# Altium project controller.PrjPcb
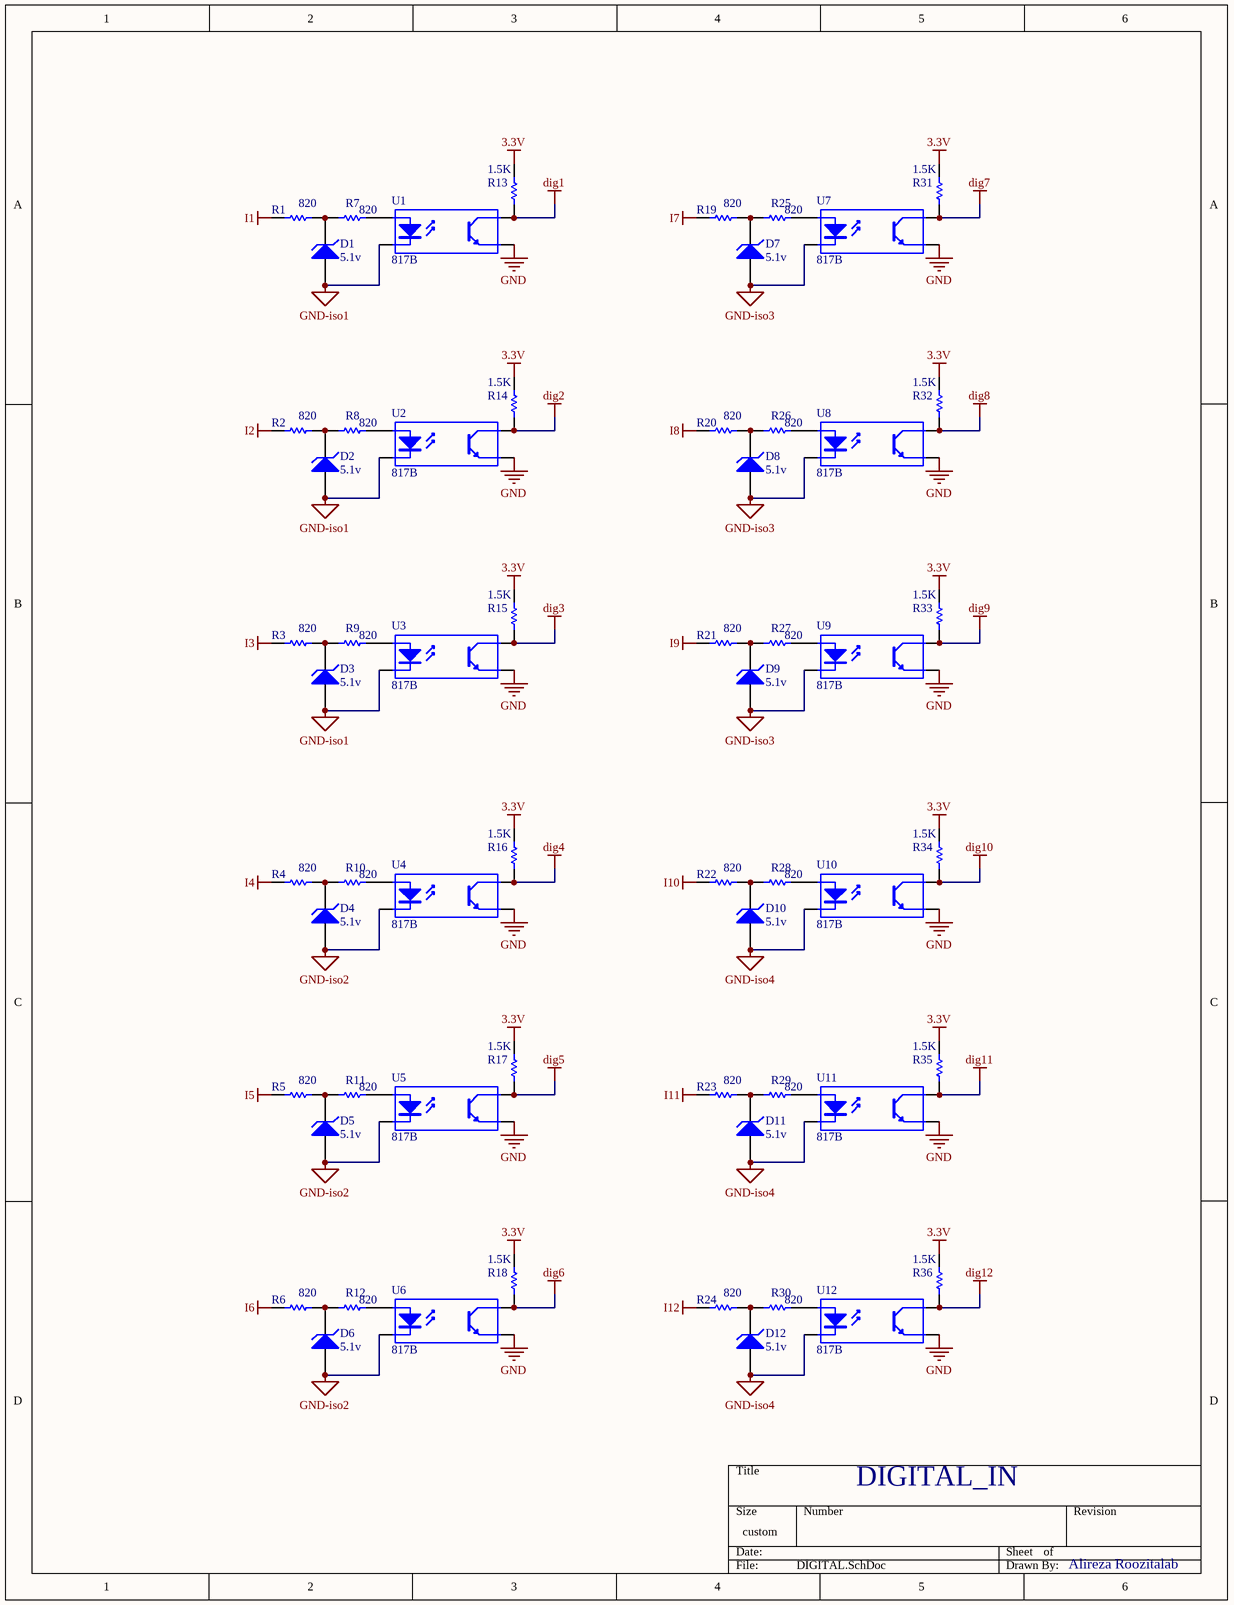
[diagram p0: DIGITAL.SchDoc]
8 sheets, 227 parts. Net scope: global (net labels, ports and power ports of the same name join across sheets).
Board file: controller.PcbDoc
Sheets:
  DIGITAL.SchDoc
  RELAY.SchDoc
  ANALOG.SchDoc
  MOSFET.SchDoc
  COMMUNICATION.SchDoc
  CORE.SchDoc
  POWER.SchDoc
  OUTPUT.SchDoc

## Sheet DIGITAL.SchDoc
size 229 x 299 mm

### Parts
D1  5.1v  [Diode-1n4148 - SMD PAD]
D2  5.1v  [Diode-1n4148 - SMD PAD]
D3  5.1v  [Diode-1n4148 - SMD PAD]
D4  5.1v  [Diode-1n4148 - SMD PAD]
D5  5.1v  [Diode-1n4148 - SMD PAD]
D6  5.1v  [Diode-1n4148 - SMD PAD]
D7  5.1v  [Diode-1n4148 - SMD PAD]
D8  5.1v  [Diode-1n4148 - SMD PAD]
D9  5.1v  [Diode-1n4148 - SMD PAD]
D10  5.1v  [Diode-1n4148 - SMD PAD]
D11  5.1v  [Diode-1n4148 - SMD PAD]
D12  5.1v  [Diode-1n4148 - SMD PAD]
R1  value 820  [RES 1206 (3216X08L)]  (hidden comment: Res Semi)
R2  value 820  [RES 1206 (3216X08L)]  (hidden comment: Res Semi)
R3  value 820  [RES 1206 (3216X08L)]  (hidden comment: Res Semi)
R4  value 820  [RES 1206 (3216X08L)]  (hidden comment: Res Semi)
R5  value 820  [RES 1206 (3216X08L)]  (hidden comment: Res Semi)
R6  value 820  [RES 1206 (3216X08L)]  (hidden comment: Res Semi)
R7  value 820  [RES 1206 (3216X08L)]  (hidden comment: Res Semi)
R8  value 820  [RES 1206 (3216X08L)]  (hidden comment: Res Semi)
R9  value 820  [RES 1206 (3216X08L)]  (hidden comment: Res Semi)
R10  value 820  [RES 1206 (3216X08L)]  (hidden comment: Res Semi)
R11  value 820  [RES 1206 (3216X08L)]  (hidden comment: Res Semi)
R12  value 820  [RES 1206 (3216X08L)]  (hidden comment: Res Semi)
R13  value 1.5K  [RES 1206 (3216X08L)]  (hidden comment: Res Semi)
R14  value 1.5K  [RES 1206 (3216X08L)]  (hidden comment: Res Semi)
R15  value 1.5K  [RES 1206 (3216X08L)]  (hidden comment: Res Semi)
R16  value 1.5K  [RES 1206 (3216X08L)]  (hidden comment: Res Semi)
R17  value 1.5K  [RES 1206 (3216X08L)]  (hidden comment: Res Semi)
R18  value 1.5K  [RES 1206 (3216X08L)]  (hidden comment: Res Semi)
R19  value 820  [RES 1206 (3216X08L)]  (hidden comment: Res Semi)
R20  value 820  [RES 1206 (3216X08L)]  (hidden comment: Res Semi)
R21  value 820  [RES 1206 (3216X08L)]  (hidden comment: Res Semi)
R22  value 820  [RES 1206 (3216X08L)]  (hidden comment: Res Semi)
R23  value 820  [RES 1206 (3216X08L)]  (hidden comment: Res Semi)
R24  value 820  [RES 1206 (3216X08L)]  (hidden comment: Res Semi)
R25  value 820  [RES 1206 (3216X08L)]  (hidden comment: Res Semi)
R26  value 820  [RES 1206 (3216X08L)]  (hidden comment: Res Semi)
R27  value 820  [RES 1206 (3216X08L)]  (hidden comment: Res Semi)
R28  value 820  [RES 1206 (3216X08L)]  (hidden comment: Res Semi)
R29  value 820  [RES 1206 (3216X08L)]  (hidden comment: Res Semi)
R30  value 820  [RES 1206 (3216X08L)]  (hidden comment: Res Semi)
R31  value 1.5K  [RES 1206 (3216X08L)]  (hidden comment: Res Semi)
R32  value 1.5K  [RES 1206 (3216X08L)]  (hidden comment: Res Semi)
R33  value 1.5K  [RES 1206 (3216X08L)]  (hidden comment: Res Semi)
R34  value 1.5K  [RES 1206 (3216X08L)]  (hidden comment: Res Semi)
R35  value 1.5K  [RES 1206 (3216X08L)]  (hidden comment: Res Semi)
R36  value 1.5K  [RES 1206 (3216X08L)]  (hidden comment: Res Semi)
U1  817B  [DIP+4]
U2  817B  [DIP+4]
U3  817B  [DIP+4]
U4  817B  [DIP+4]
U5  817B  [DIP+4]
U6  817B  [DIP+4]
U7  817B  [DIP+4]
U8  817B  [DIP+4]
U9  817B  [DIP+4]
U10  817B  [DIP+4]
U11  817B  [DIP+4]
U12  817B  [DIP+4]

### Nets
3.3V: R13.2 R14.2 R15.2 R16.2 R17.2 R18.2 R31.2 R32.2 R33.2 R34.2 R35.2 R36.2
dig1: R13.1 U1.4(C)
dig2: R14.1 U2.4(C)
dig3: R15.1 U3.4(C)
dig4: R16.1 U4.4(C)
dig5: R17.1 U5.4(C)
dig6: R18.1 U6.4(C)
dig7: R31.1 U7.4(C)
dig8: R32.1 U8.4(C)
dig9: R33.1 U9.4(C)
dig10: R34.1 U10.4(C)
dig11: R35.1 U11.4(C)
dig12: R36.1 U12.4(C)
GND: U1.3(E) U2.3(E) U3.3(E) U4.3(E) U5.3(E) U6.3(E) U7.3(E) U8.3(E) U9.3(E) U10.3(E) U11.3(E) U12.3(E)
GND-iso1: D1.1(A) D2.1(A) D3.1(A) U1.2(K) U2.2(K) U3.2(K)
GND-iso2: D4.1(A) D5.1(A) D6.1(A) U4.2(K) U5.2(K) U6.2(K)
GND-iso3: D7.1(A) D8.1(A) D9.1(A) U7.2(K) U8.2(K) U9.2(K)
GND-iso4: D10.1(A) D11.1(A) D12.1(A) U10.2(K) U11.2(K) U12.2(K)
I1: R1.1
I2: R2.1
I3: R3.1
I4: R4.1
I5: R5.1
I6: R6.1
I7: R19.1
I8: R20.1
I9: R21.1
I10: R22.1
I11: R23.1
I12: R24.1
NetD1_2: D1.2(K) R1.2 R7.1
NetD2_2: D2.2(K) R2.2 R8.1
NetD3_2: D3.2(K) R3.2 R9.1
NetD4_2: D4.2(K) R4.2 R10.1
NetD5_2: D5.2(K) R5.2 R11.1
NetD6_2: D6.2(K) R6.2 R12.1
NetD7_2: D7.2(K) R19.2 R25.1
NetD8_2: D8.2(K) R20.2 R26.1
NetD9_2: D9.2(K) R21.2 R27.1
NetD10_2: D10.2(K) R22.2 R28.1
NetD11_2: D11.2(K) R23.2 R29.1
NetD12_2: D12.2(K) R24.2 R30.1
NetR7_2: R7.2 U1.1(A)
NetR8_2: R8.2 U2.1(A)
NetR9_2: R9.2 U3.1(A)
NetR10_2: R10.2 U4.1(A)
NetR11_2: R11.2 U5.1(A)
NetR12_2: R12.2 U6.1(A)
NetR25_2: R25.2 U7.1(A)
NetR26_2: R26.2 U8.1(A)
NetR27_2: R27.2 U9.1(A)
NetR28_2: R28.2 U10.1(A)
NetR29_2: R29.2 U11.1(A)
NetR30_2: R30.2 U12.1(A)

### Notes on the sheet
- DIGITAL_IN
- Alireza Roozitalab

### Library data of the parts
D1-D12 = D Zener: Zener Diode; Published: 8-Jun-2000; LatestRevisionDate: 17-Jul-2002; LatestRevisionNote: Re-released for DXP Platform.; PackageReference: DIODE-0.7; Publisher: Altium Limited
R1-R36 = Res Semi: Semiconductor Resistor; Published: 8-Jun-2000; LatestRevisionDate: 17-Jul-2002; LatestRevisionNote: Re-released for DXP Platform.; PackageReference: AXIAL-0.5; Publisher: Altium Limited
U1-U12 = Optoisolator1: 4-Pin Phototransistor Optocoupler; Published: 24-Mar-1999; LatestRevisionDate: 04-Mar-2005; LatestRevisionNote: Sch pins 3 & 4 Swapped.; DatasheetDocument: Nov-2003; PackageReference: DIP-4; Publisher: Altium Limited

## Sheet RELAY.SchDoc
size 199 x 199 mm
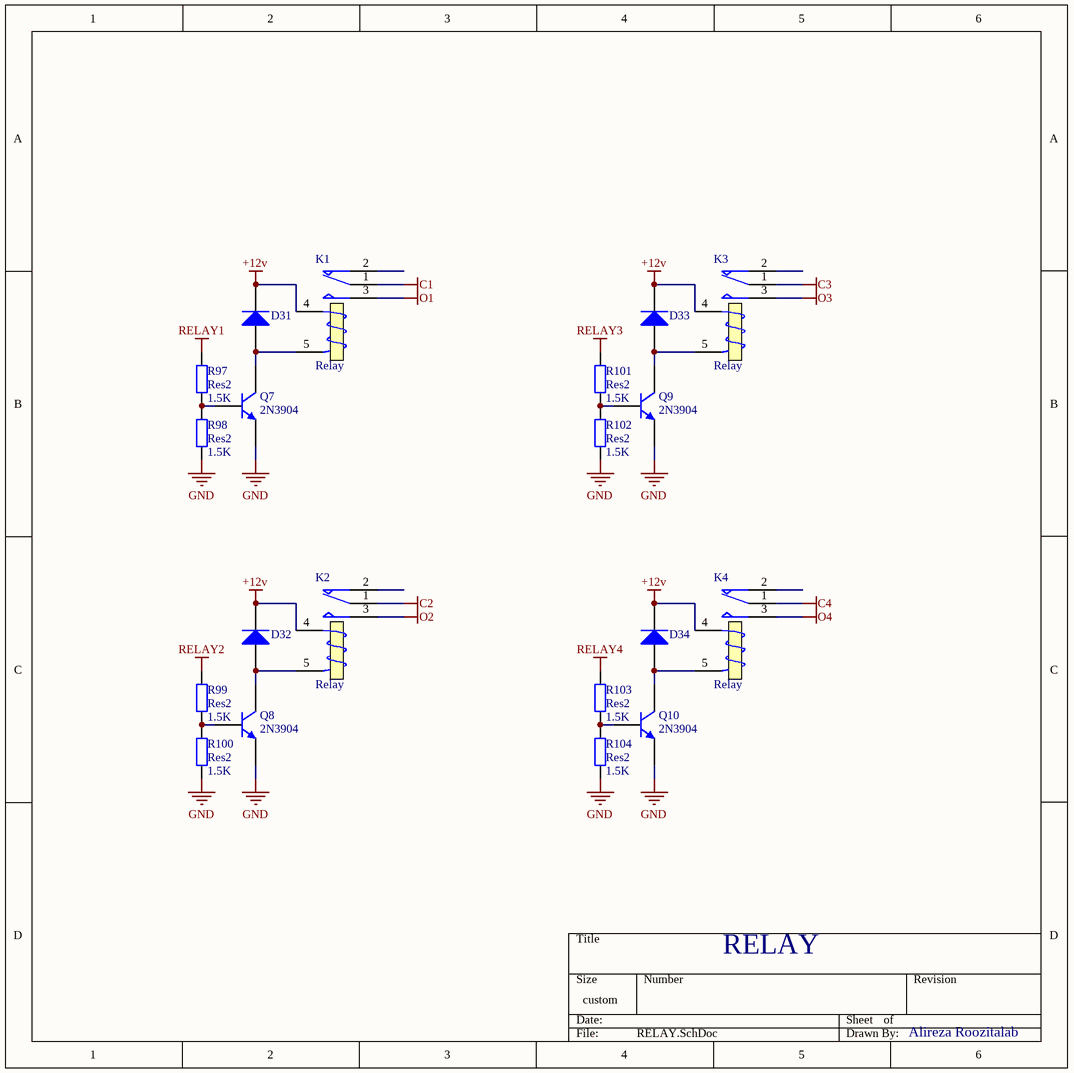
[diagram p1: RELAY.SchDoc]

### Parts
D31  Diode 1N4148  [Diode-1n4148 - SMD PAD]  (value not drawn)
D32  Diode 1N4148  [Diode-1n4148 - SMD PAD]  (value not drawn)
D33  Diode 1N4148  [Diode-1n4148 - SMD PAD]  (value not drawn)
D34  Diode 1N4148  [Diode-1n4148 - SMD PAD]  (value not drawn)
K1  Relay  [RELAY 12V ATX203]
K2  Relay  [RELAY 12V ATX203]
K3  Relay  [RELAY 12V ATX203]
K4  Relay  [RELAY 12V ATX203]
Q7  2N3904  [2N3906_SMD]
Q8  2N3904  [2N3906_SMD]
Q9  2N3904  [2N3906_SMD]
Q10  2N3904  [2N3906_SMD]
R97  Res2  value 1.5K  [RES 1206 (3216X08L)]
R98  Res2  value 1.5K  [RES 1206 (3216X08L)]
R99  Res2  value 1.5K  [RES 1206 (3216X08L)]
R100  Res2  value 1.5K  [RES 1206 (3216X08L)]
R101  Res2  value 1.5K  [RES 1206 (3216X08L)]
R102  Res2  value 1.5K  [RES 1206 (3216X08L)]
R103  Res2  value 1.5K  [RES 1206 (3216X08L)]
R104  Res2  value 1.5K  [RES 1206 (3216X08L)]

### Nets
+12v: D31.2(K) D32.2(K) D33.2(K) D34.2(K) K1.4 K2.4 K3.4 K4.4
C1: K1.1
C2: K2.1
C3: K3.1
C4: K4.1
GND: Q7.1(E) Q8.1(E) Q9.1(E) Q10.1(E) R98.1 R100.1 R102.1 R104.1
O1: K1.3
O2: K2.3
O3: K3.3
O4: K4.3
RELAY1: R97.2
RELAY2: R99.2
RELAY3: R101.2
RELAY4: R103.2
NetD31_1: D31.1(A) K1.5 Q7.3(C)
NetD32_1: D32.1(A) K2.5 Q8.3(C)
NetD33_1: D33.1(A) K3.5 Q9.3(C)
NetD34_1: D34.1(A) K4.5 Q10.3(C)
NetQ7_2: Q7.2(B) R97.1 R98.2
NetQ8_2: Q8.2(B) R99.1 R100.2
NetQ9_2: Q9.2(B) R101.1 R102.2
NetQ10_2: Q10.2(B) R103.1 R104.2

Not connected (* = marked no-connect by the designer): K1 2; K2 2; K3 2; K4 2

### Notes on the sheet
- RELAY
- Alireza Roozitalab

### Library data of the parts
D31-D34 = Diode 1N4148: High Conductance Fast Diode; Published: 8-Jun-2000; LatestRevisionDate: 17-Jul-2002; LatestRevisionNote: Re-released for DXP Platform.; DatasheetDocument: 1997; PackageReference: DO-35; Publisher: Altium Limited; Code_JEDEC: DO-204-AH; ComponentLink1Description: Manufacturer Link; ComponentLink1URL: http://www.fairchildsemi.com/; ComponentLink2Description: Datasheet; ComponentLink2URL: http://www.fairchildsemi.com/ds/1N%2F1N4148.pdf
K1-K4 = Relay: SPDT Relay; Published: 8-Jun-2000; LatestRevisionDate: 17-Jul-2002; LatestRevisionNote: Re-released for DXP Platform.; PackageReference: MODULE5B; Publisher: Altium Limited
Q7-Q10 = 2N3904: NPN General Purpose Amplifier; pin to pad: 1>2 2>1; Published: 8-Jun-2000; LatestRevisionDate: 15-Jan-2003; LatestRevisionNote: PCB Footprint 'BCY-W3/D4.7' replaced; DatasheetDocument: 1997; PackageDocument: Sep-1998; PackageReference: TO-92A; Publisher: Altium Limited; Code_JEDEC: TO-92A; ComponentLink1Description: Manufacturer Link; ComponentLink1URL: http://www.fairchildsemi.com/; ComponentLink2Description: Datasheet; ComponentLink2URL: http://www.fairchildsemi.com/ds/2N%2F2N3904.pdf
R97-R104 = Res2: Resistor; Published: 8-Jun-2000; LatestRevisionDate: 17-Jul-2002; LatestRevisionNote: Re-released for DXP Platform.; PackageReference: AXIAL-0.4; Publisher: Altium Limited

## Sheet ANALOG.SchDoc
size A3
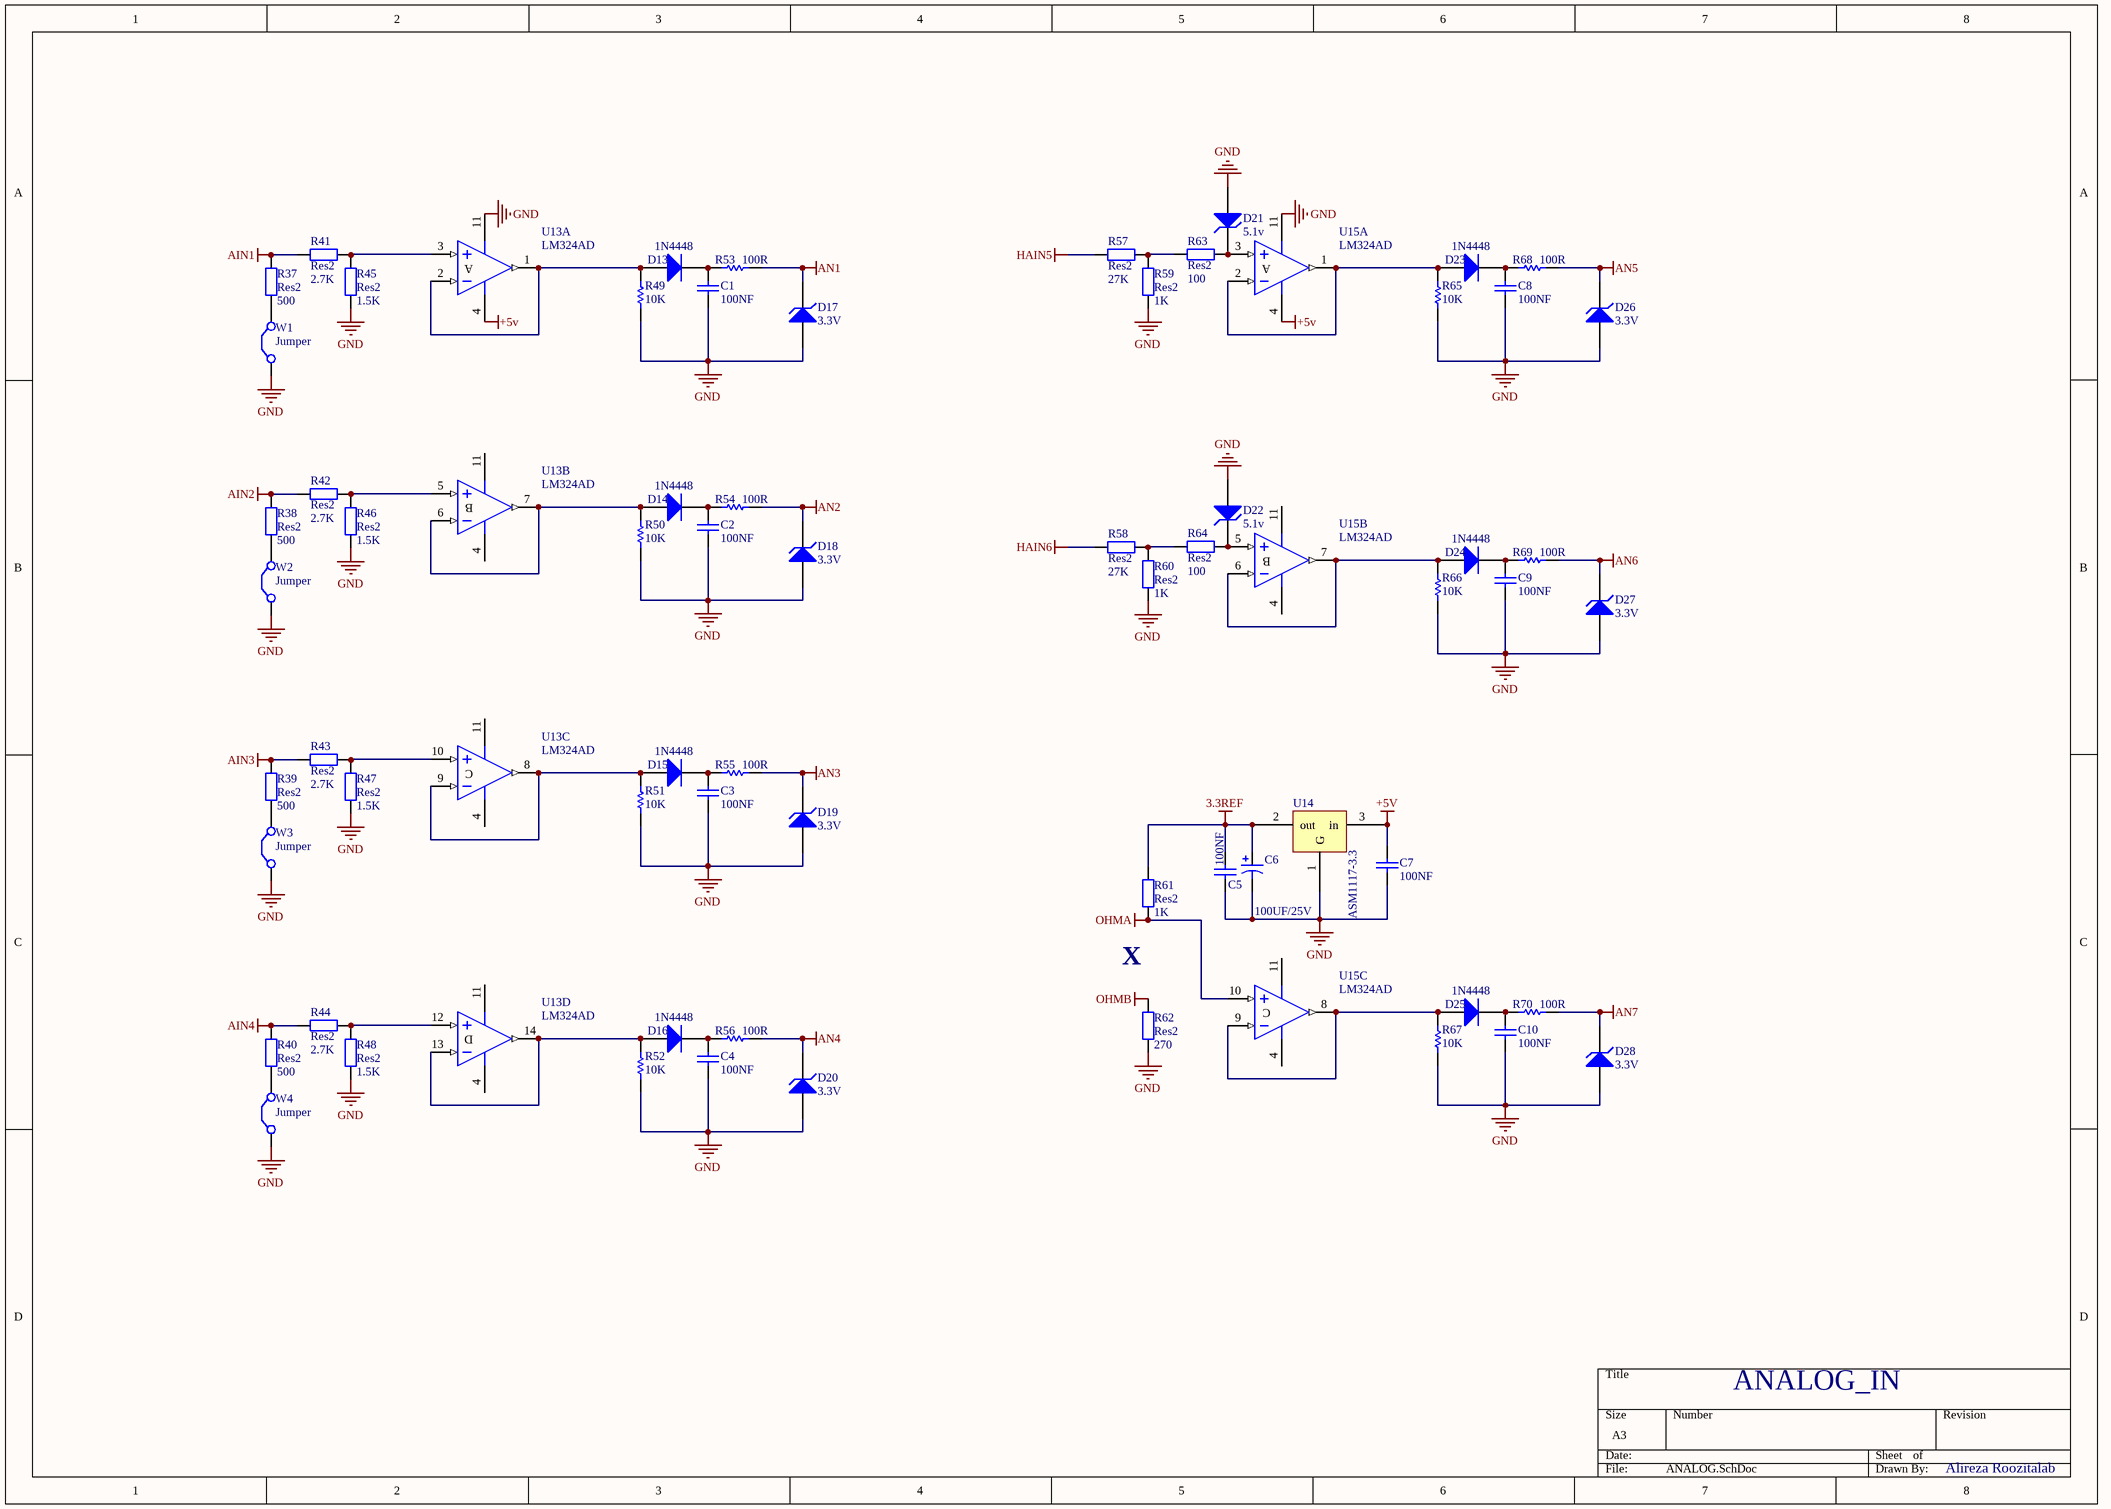
[diagram p2: ANALOG.SchDoc]

### Parts
C1  value 100NF  [CAP 1206 (3216X08L)]  (hidden comment: Cap)
C2  value 100NF  [CAP 1206 (3216X08L)]  (hidden comment: Cap)
C3  value 100NF  [CAP 1206 (3216X08L)]  (hidden comment: Cap)
C4  value 100NF  [CAP 1206 (3216X08L)]  (hidden comment: Cap)
C5  value 100NF  [CAP 1206 (3216X08L)]  (hidden comment: Cap)
C6  value 100UF/25V  [POL 100U/25V]  (hidden comment: Cap Pol1)
C7  value 100NF  [CAP 1206 (3216X08L)]  (hidden comment: Cap)
C8  value 100NF  [CAP 1206 (3216X08L)]  (hidden comment: Cap)
C9  value 100NF  [CAP 1206 (3216X08L)]  (hidden comment: Cap)
C10  value 100NF  [CAP 1206 (3216X08L)]  (hidden comment: Cap)
D13  1N4448  [Diode-1n4148 - SMD PAD]
D14  1N4448  [Diode-1n4148 - SMD PAD]
D15  1N4448  [Diode-1n4148 - SMD PAD]
D16  1N4448  [Diode-1n4148 - SMD PAD]
D17  3.3V  [Diode-1n4148 - SMD PAD]
D18  3.3V  [Diode-1n4148 - SMD PAD]
D19  3.3V  [Diode-1n4148 - SMD PAD]
D20  3.3V  [Diode-1n4148 - SMD PAD]
D21  5.1v  [Diode-1n4148 - SMD PAD]
D22  5.1v  [Diode-1n4148 - SMD PAD]
D23  1N4448  [Diode-1n4148 - SMD PAD]
D24  1N4448  [Diode-1n4148 - SMD PAD]
D25  1N4448  [Diode-1n4148 - SMD PAD]
D26  3.3V  [Diode-1n4148 - SMD PAD]
D27  3.3V  [Diode-1n4148 - SMD PAD]
D28  3.3V  [Diode-1n4148 - SMD PAD]
R37  Res2  value 500  [RES 1206 (3216X08L)]
R38  Res2  value 500  [RES 1206 (3216X08L)]
R39  Res2  value 500  [RES 1206 (3216X08L)]
R40  Res2  value 500  [RES 1206 (3216X08L)]
R41  Res2  value 2.7K  [RES 1206 (3216X08L)]
R42  Res2  value 2.7K  [RES 1206 (3216X08L)]
R43  Res2  value 2.7K  [RES 1206 (3216X08L)]
R44  Res2  value 2.7K  [RES 1206 (3216X08L)]
R45  Res2  value 1.5K  [RES 1206 (3216X08L)]
R46  Res2  value 1.5K  [RES 1206 (3216X08L)]
R47  Res2  value 1.5K  [RES 1206 (3216X08L)]
R48  Res2  value 1.5K  [RES 1206 (3216X08L)]
R49  value 10K  [RES 1206 (3216X08L)]  (hidden comment: Res Semi)
R50  value 10K  [RES 1206 (3216X08L)]  (hidden comment: Res Semi)
R51  value 10K  [RES 1206 (3216X08L)]  (hidden comment: Res Semi)
R52  value 10K  [RES 1206 (3216X08L)]  (hidden comment: Res Semi)
R53  value 100R  [RES 1206 (3216X08L)]  (hidden comment: Res Semi)
R54  value 100R  [RES 1206 (3216X08L)]  (hidden comment: Res Semi)
R55  value 100R  [RES 1206 (3216X08L)]  (hidden comment: Res Semi)
R56  value 100R  [RES 1206 (3216X08L)]  (hidden comment: Res Semi)
R57  Res2  value 27K  [RES 1206 (3216X08L)]
R58  Res2  value 27K  [RES 1206 (3216X08L)]
R59  Res2  value 1K  [RES 1206 (3216X08L)]
R60  Res2  value 1K  [RES 1206 (3216X08L)]
R61  Res2  value 1K  [RES 1206 (3216X08L)]
R62  Res2  value 270  [RES 1206 (3216X08L)]
R63  Res2  value 100  [RES 1206 (3216X08L)]
R64  Res2  value 100  [RES 1206 (3216X08L)]
R65  value 10K  [RES 1206 (3216X08L)]  (hidden comment: Res Semi)
R66  value 10K  [RES 1206 (3216X08L)]  (hidden comment: Res Semi)
R67  value 10K  [RES 1206 (3216X08L)]  (hidden comment: Res Semi)
R68  value 100R  [RES 1206 (3216X08L)]  (hidden comment: Res Semi)
R69  value 100R  [RES 1206 (3216X08L)]  (hidden comment: Res Semi)
R70  value 100R  [RES 1206 (3216X08L)]  (hidden comment: Res Semi)
U13  LM324AD  [SOP-14]  (parts A,B,C,D of 4)
U14  ASM1117-3.3  [SOT-223]
U15  LM324AD  [SOP-14]  (parts A,B,C of 4)
W1  Jumper  [RES 0402 (1005X04L)]
W2  Jumper  [RES 0402 (1005X04L)]
W3  Jumper  [RES 0402 (1005X04L)]
W4  Jumper  [RES 0402 (1005X04L)]

### Nets
3.3REF: C5.2 C6.1 R61.2 U14.2(out)
+5v: C7.2 U13.4(V+) U14.3(in) U15.4(V+)
AIN1: R37.2 R41.1
AIN2: R38.2 R42.1
AIN3: R39.2 R43.1
AIN4: R40.2 R44.1
AN1: D17.2(K) R53.2
AN2: D18.2(K) R54.2
AN3: D19.2(K) R55.2
AN4: D20.2(K) R56.2
AN5: D26.2(K) R68.2
AN6: D27.2(K) R69.2
AN7: D28.2(K) R70.2
GND: C1.2 C2.2 C3.2 C4.2 C5.1 C6.2 C7.1 C8.2 C9.2 C10.2 D17.1(A) D18.1(A) D19.1(A) D20.1(A) D21.1(A) D22.1(A) D26.1(A) D27.1(A) D28.1(A) R45.1 R46.1 R47.1 R48.1 R49.1 R50.1 R51.1 R52.1 R59.1 R60.1 R62.1 R65.1 R66.1 R67.1 U13.11(V-) U14.1(G) U15.11(V-) W1.1(C1) W2.1(C1) W3.1(C1) W4.1(C1)
HAIN5: R57.1
HAIN6: R58.1
OHMA: R61.1 U15.10(IN+)
OHMB: R62.2
NetC1_1: C1.1 D13.2(K) R53.1
NetC2_1: C2.1 D14.2(K) R54.1
NetC3_1: C3.1 D15.2(K) R55.1
NetC4_1: C4.1 D16.2(K) R56.1
NetC8_1: C8.1 D23.2(K) R68.1
NetC9_1: C9.1 D24.2(K) R69.1
NetC10_1: C10.1 D25.2(K) R70.1
NetD13_1: D13.1(A) R49.2 U13.1(OUT) U13.2(IN-)
NetD14_1: D14.1(A) R50.2 U13.6(IN-) U13.7(OUT)
NetD15_1: D15.1(A) R51.2 U13.8(OUT) U13.9(IN-)
NetD16_1: D16.1(A) R52.2 U13.13(IN-) U13.14(OUT)
NetD21_2: D21.2(K) R63.2 U15.3(IN+)
NetD22_2: D22.2(K) R64.2 U15.5(IN+)
NetD23_1: D23.1(A) R65.2 U15.1(OUT) U15.2(IN-)
NetD24_1: D24.1(A) R66.2 U15.6(IN-) U15.7(OUT)
NetD25_1: D25.1(A) R67.2 U15.8(OUT) U15.9(IN-)
NetR37_1: R37.1 W1.2(C2)
NetR38_1: R38.1 W2.2(C2)
NetR39_1: R39.1 W3.2(C2)
NetR40_1: R40.1 W4.2(C2)
NetR41_2: R41.2 R45.2 U13.3(IN+)
NetR42_2: R42.2 R46.2 U13.5(IN+)
NetR43_2: R43.2 R47.2 U13.10(IN+)
NetR44_2: R44.2 R48.2 U13.12(IN+)
NetR57_2: R57.2 R59.2 R63.1
NetR58_2: R58.2 R60.2 R64.1

### Notes on the sheet
- X
- ANALOG_IN
- Alireza Roozitalab
- (in symbol LM324AD, part A) A
- (in symbol LM324AD, part B) B
- (in symbol LM324AD, part C) C
- (in symbol LM324AD, part D) D

### Library data of the parts
C1-C5 C7-C10 = Cap: Capacitor; Published: 8-Jun-2000; LatestRevisionDate: 17-Jul-2002; LatestRevisionNote: Re-released for DXP Platform.; PackageReference: RAD-0.3; Publisher: Altium Limited
C6 = Cap Pol1: Polarized Capacitor (Radial); Published: 8-Jun-2000; LatestRevisionDate: 17-Jul-2002; LatestRevisionNote: Re-released for DXP Platform.; PackageReference: RB7.6-15; Publisher: Altium Limited
D13-D16 D23-D25 = Diode: Default Diode; Published: 8-Jun-2000; LatestRevisionDate: 17-Jul-2002; LatestRevisionNote: Re-released for DXP Platform.; PackageDocument: Sep-1996; PackageReference: SMC; Publisher: Altium Limited; Code_JEDEC: DO-214-AB
D17-D22 D26-D28 = D Zener: Zener Diode; Published: 8-Jun-2000; LatestRevisionDate: 17-Jul-2002; LatestRevisionNote: Re-released for DXP Platform.; PackageReference: DIODE-0.7; Publisher: Altium Limited
R37-R48 R57-R64 = Res2: Resistor; Published: 8-Jun-2000; LatestRevisionDate: 17-Jul-2002; LatestRevisionNote: Re-released for DXP Platform.; PackageReference: AXIAL-0.4; Publisher: Altium Limited
R49-R56 R65-R70 = Res Semi: Semiconductor Resistor; Published: 8-Jun-2000; LatestRevisionDate: 17-Jul-2002; LatestRevisionNote: Re-released for DXP Platform.; PackageReference: AXIAL-0.5; Publisher: Altium Limited
U13 U15 = LM324AD: Low-Power Quad Operational Amplifier; Published: 24-Aug-2001; LatestRevisionDate: 13-Apr-2006; LatestRevisionNote: IPC-7351 Footprint Added.; DatasheetVersion: Nov-1997; PackageVersion: Sep-1998; PackageReference: SO14; Publisher: Altium Limited; PackageDescription: 14-Pin Small Outline Integrated Circuit 1.27 mm Pitch; Code_IPC: SOIC127P600-14; ComponentLink1Description: Manufacturer Link; ComponentLink1URL: http://www.st.com/; ComponentLink2Description: Datasheet; ComponentLink2URL: http://www.st.com/stonline/products/literature/ds/4797/lm224a.pdf
W1-W4 = Jumper: Jumper Wire; Published: 24-Mar-1999; LatestRevisionDate: 17-Jul-2002; LatestRevisionNote: Re-released for DXP Platform.; PackageReference: RAD-0.2; Publisher: Altium Limited

## Sheet MOSFET.SchDoc
size 149 x 100 mm
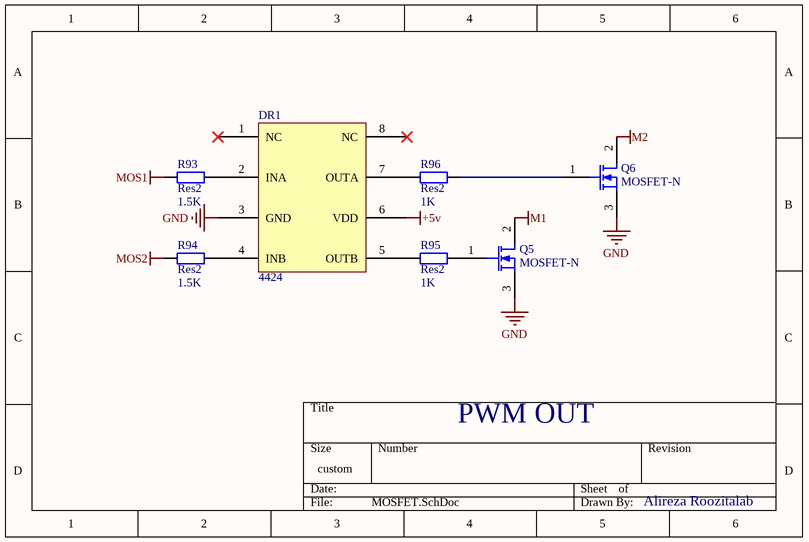
[diagram p3: MOSFET.SchDoc]

### Parts
DR1  4424  [SOP8]
Q5  MOSFET-N  [dpak-to252]
Q6  MOSFET-N  [dpak-to252]
R93  Res2  value 1.5K  [RES 1206 (3216X08L)]
R94  Res2  value 1.5K  [RES 1206 (3216X08L)]
R95  Res2  value 1K  [RES 1206 (3216X08L)]
R96  Res2  value 1K  [RES 1206 (3216X08L)]

### Nets
+5v: DR1.6(VDD)
GND: DR1.3(GND) Q5.3(S) Q6.3(S)
M1: Q5.2(D)
M2: Q6.2(D)
MOS1: R93.1
MOS2: R94.1
NetDR1_2: DR1.2(INA) R93.2
NetDR1_4: DR1.4(INB) R94.2
NetDR1_5: DR1.5(OUTB) R95.1
NetDR1_7: DR1.7(OUTA) R96.1
NetQ5_1: Q5.1(G) R95.2
NetQ6_1: Q6.1(G) R96.2

Not connected (* = marked no-connect by the designer): DR1 1(NC)* 8(NC)*

### Notes on the sheet
- PWM OUT
- Alireza Roozitalab

### Library data of the parts
Q5 Q6 = MOSFET-N: N-Channel MOSFET; PackageDocument: 1995/1996; Published: 8-Jun-2000; LatestRevisionDate: 17-Jul-2002; LatestRevisionNote: Re-released for DXP Platform.; PackageReference: E3; Publisher: Altium Limited
R93-R96 = Res2: Resistor; Published: 8-Jun-2000; LatestRevisionDate: 17-Jul-2002; LatestRevisionNote: Re-released for DXP Platform.; PackageReference: AXIAL-0.4; Publisher: Altium Limited

## Sheet COMMUNICATION.SchDoc
size 149 x 299 mm
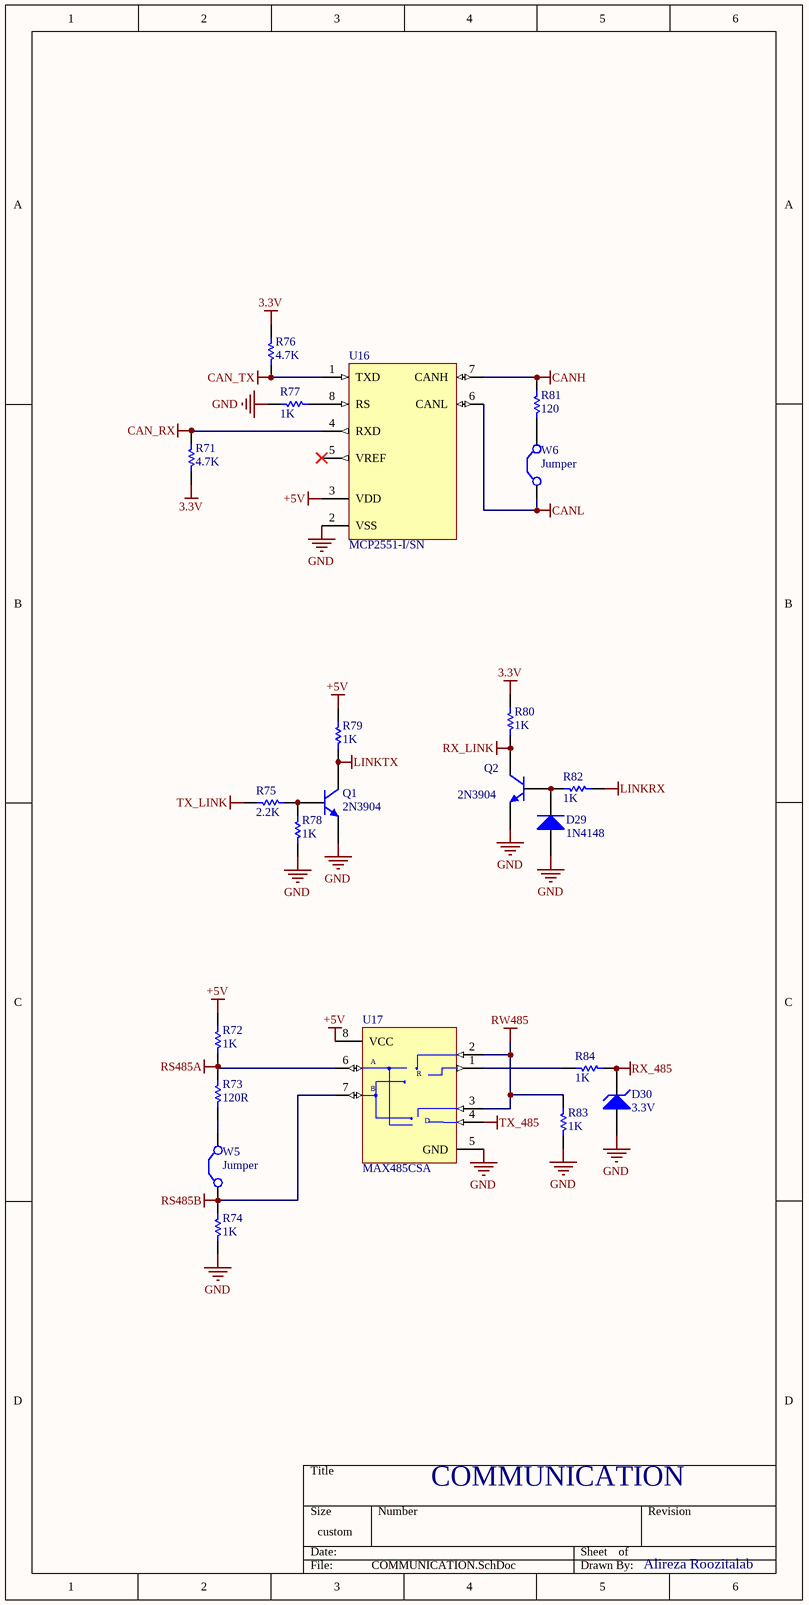
[diagram p4: COMMUNICATION.SchDoc]

### Parts
D29  1N4148  [Diode-1n4148 - SMD PAD]
D30  3.3V  [Diode-1n4148 - SMD PAD]
Q1  2N3904  [2N3906_SMD]
Q2  2N3904  [2N3906_SMD]
R71  value 4.7K  [RES 1206 (3216X08L)]  (hidden comment: Res Semi)
R72  value 1K  [RES 1206 (3216X08L)]  (hidden comment: Res Semi)
R73  value 120R  [RES 1206 (3216X08L)]  (hidden comment: Res Semi)
R74  value 1K  [RES 1206 (3216X08L)]  (hidden comment: Res Semi)
R75  value 2.2K  [RES 1206 (3216X08L)]  (hidden comment: Res Semi)
R76  value 4.7K  [RES 1206 (3216X08L)]  (hidden comment: Res Semi)
R77  value 1K  [RES 1206 (3216X08L)]  (hidden comment: Res Semi)
R78  value 1K  [RES 1206 (3216X08L)]  (hidden comment: Res Semi)
R79  value 1K  [RES 1206 (3216X08L)]  (hidden comment: Res Semi)
R80  value 1K  [RES 1206 (3216X08L)]  (hidden comment: Res Semi)
R81  value 120  [RES 1206 (3216X08L)]  (hidden comment: Res Semi)
R82  value 1K  [RES 1206 (3216X08L)]  (hidden comment: Res Semi)
R83  value 1K  [RES 1206 (3216X08L)]  (hidden comment: Res Semi)
R84  value 1K  [RES 1206 (3216X08L)]  (hidden comment: Res Semi)
U16  MCP2551-I/SN  [SOP8]
U17  MAX485CSA  [SOP8]
W5  Jumper  [RES 0402 (1005X04L)]
W6  Jumper  [RES 0402 (1005X04L)]

### Nets
3.3V: R71.2 R76.1 R80.1
+5v: R72.2 R79.1 U16.3(VDD) U17.8(VCC)
CAN_RX: R71.1 U16.4(RXD)
CAN_TX: R76.2 U16.1(TXD)
CANH: R81.1 U16.7(CANH)
CANL: U16.6(CANL) W6.1(C1)
GND: D29.1(A) D30.1(A) Q1.1(E) Q2.1(E) R74.1 R77.1 R78.2 R83.1 U16.2(VSS) U17.5(GND)
LINKRX: R82.2
LINKTX: Q1.3(C) R79.2
RS485A: R72.1 R73.2 U17.6(A)
RS485B: R74.2 U17.7(B) W5.1(C1)
RW485: R83.2 U17.2(~{RE}) U17.3(DE)
RX_485: D30.2(K) R84.1
RX_LINK: Q2.3(C) R80.2
TX_485: U17.4(DI)
TX_LINK: R75.2
NetD29_2: D29.2(K) Q2.2(B) R82.1
NetQ1_2: Q1.2(B) R75.1 R78.1
NetR73_1: R73.1 W5.2(C2)
NetR77_2: R77.2 U16.8(RS)
NetR81_2: R81.2 W6.2(C2)
NetR84_2: R84.2 U17.1(RO)

Not connected (* = marked no-connect by the designer): U16 5(VREF)*

### Notes on the sheet
- COMMUNICATION
- Alireza Roozitalab
- (in symbol MAX485CSA) R; D

### Library data of the parts
D29 = Diode: Default Diode; Published: 8-Jun-2000; LatestRevisionDate: 17-Jul-2002; LatestRevisionNote: Re-released for DXP Platform.; PackageDocument: Sep-1996; PackageReference: SMC; Publisher: Altium Limited; Code_JEDEC: DO-214-AB
D30 = D Zener: Zener Diode; Published: 8-Jun-2000; LatestRevisionDate: 17-Jul-2002; LatestRevisionNote: Re-released for DXP Platform.; PackageReference: DIODE-0.7; Publisher: Altium Limited
Q1 Q2 = 2N3904: NPN General Purpose Amplifier; pin to pad: 1>2 2>1; Published: 8-Jun-2000; LatestRevisionDate: 15-Jan-2003; LatestRevisionNote: PCB Footprint 'BCY-W3/D4.7' replaced; DatasheetDocument: 1997; PackageDocument: Sep-1998; PackageReference: TO-92A; Publisher: Altium Limited; Code_JEDEC: TO-92A; ComponentLink1Description: Manufacturer Link; ComponentLink1URL: http://www.fairchildsemi.com/; ComponentLink2Description: Datasheet; ComponentLink2URL: http://www.fairchildsemi.com/ds/2N%2F2N3904.pdf
R71-R84 = Res Semi: Semiconductor Resistor; Published: 8-Jun-2000; LatestRevisionDate: 17-Jul-2002; LatestRevisionNote: Re-released for DXP Platform.; PackageReference: AXIAL-0.5; Publisher: Altium Limited
U16 = MCP2551-I/SN: High-Speed CAN Transceiver, 8-Pin SOIC, Industrial Temperature; Manufacturer: Microchip; DatasheetVersion: revF, Jul-2010; PackageVersion: revBB, Aug-2009; PackageReference: SOIC-SN8; PackageDescription: 8-Lead Plastic Small Outline (SN) - Narrow, 3.90mm Body [SOIC]; Supplier 1: Digi-Key; Supplier Part Number 1: MCP2551-I/SN-ND; Supplier 2: Farnell; Supplier Part Number 2: 9758569; Supplier 3: Newark; Supplier Part Number 3: 69K7604; Supplier 4: Mouser; Supplier Part Number 4: 579-MCP2551-I/SN; Mounting Technology: Surface Mount; Code_JEDEC: MS-012; Code_IPC: SOIC127P600-8; PartNumber: MCP2551-I/SN; ComponentLink1Description: Manufacturer URL; ComponentLink1URL: http://www.microchip.com/; ComponentLink2Description: Datasheet; ComponentLink2URL: http://ww1.microchip.com/downloads/en/DeviceDoc/21667F.pdf; ComponentLink3Description: Package Specification; ComponentLink3URL: http://www.microchip.com/stellent/groups/techpub_sg/documents/packagingspec/en012702.pdf
U17 = MAX485CSA: Low-Power, Slew-Rate-Limited RS-485/RS-422 Transceiver; Published: 16-Jan-2001; LatestRevisionDate: 13-Apr-2006; LatestRevisionNote: IPC-7351 Footprint Added.; DatasheetVersion: Feb-1996; PackageReference: NSO8; Publisher: Altium Limited; PackageDescription: 8-Pin Small Outline Integrated Circuit 1.27 mm Pitch; Code_JEDEC: MS-012-AA; Code_IPC: SOIC127P600-8; ComponentLink1Description: Manufacturer Link; ComponentLink1URL: http://www.maxim-ic.com/; ComponentLink2Description: Datasheet; ComponentLink2URL: http://pdfserv.maxim-ic.com/en/ds/MAX1487-MAX491.pdf
W5 W6 = Jumper: Jumper Wire; Published: 24-Mar-1999; LatestRevisionDate: 17-Jul-2002; LatestRevisionNote: Re-released for DXP Platform.; PackageReference: RAD-0.2; Publisher: Altium Limited

## Sheet CORE.SchDoc
size A3
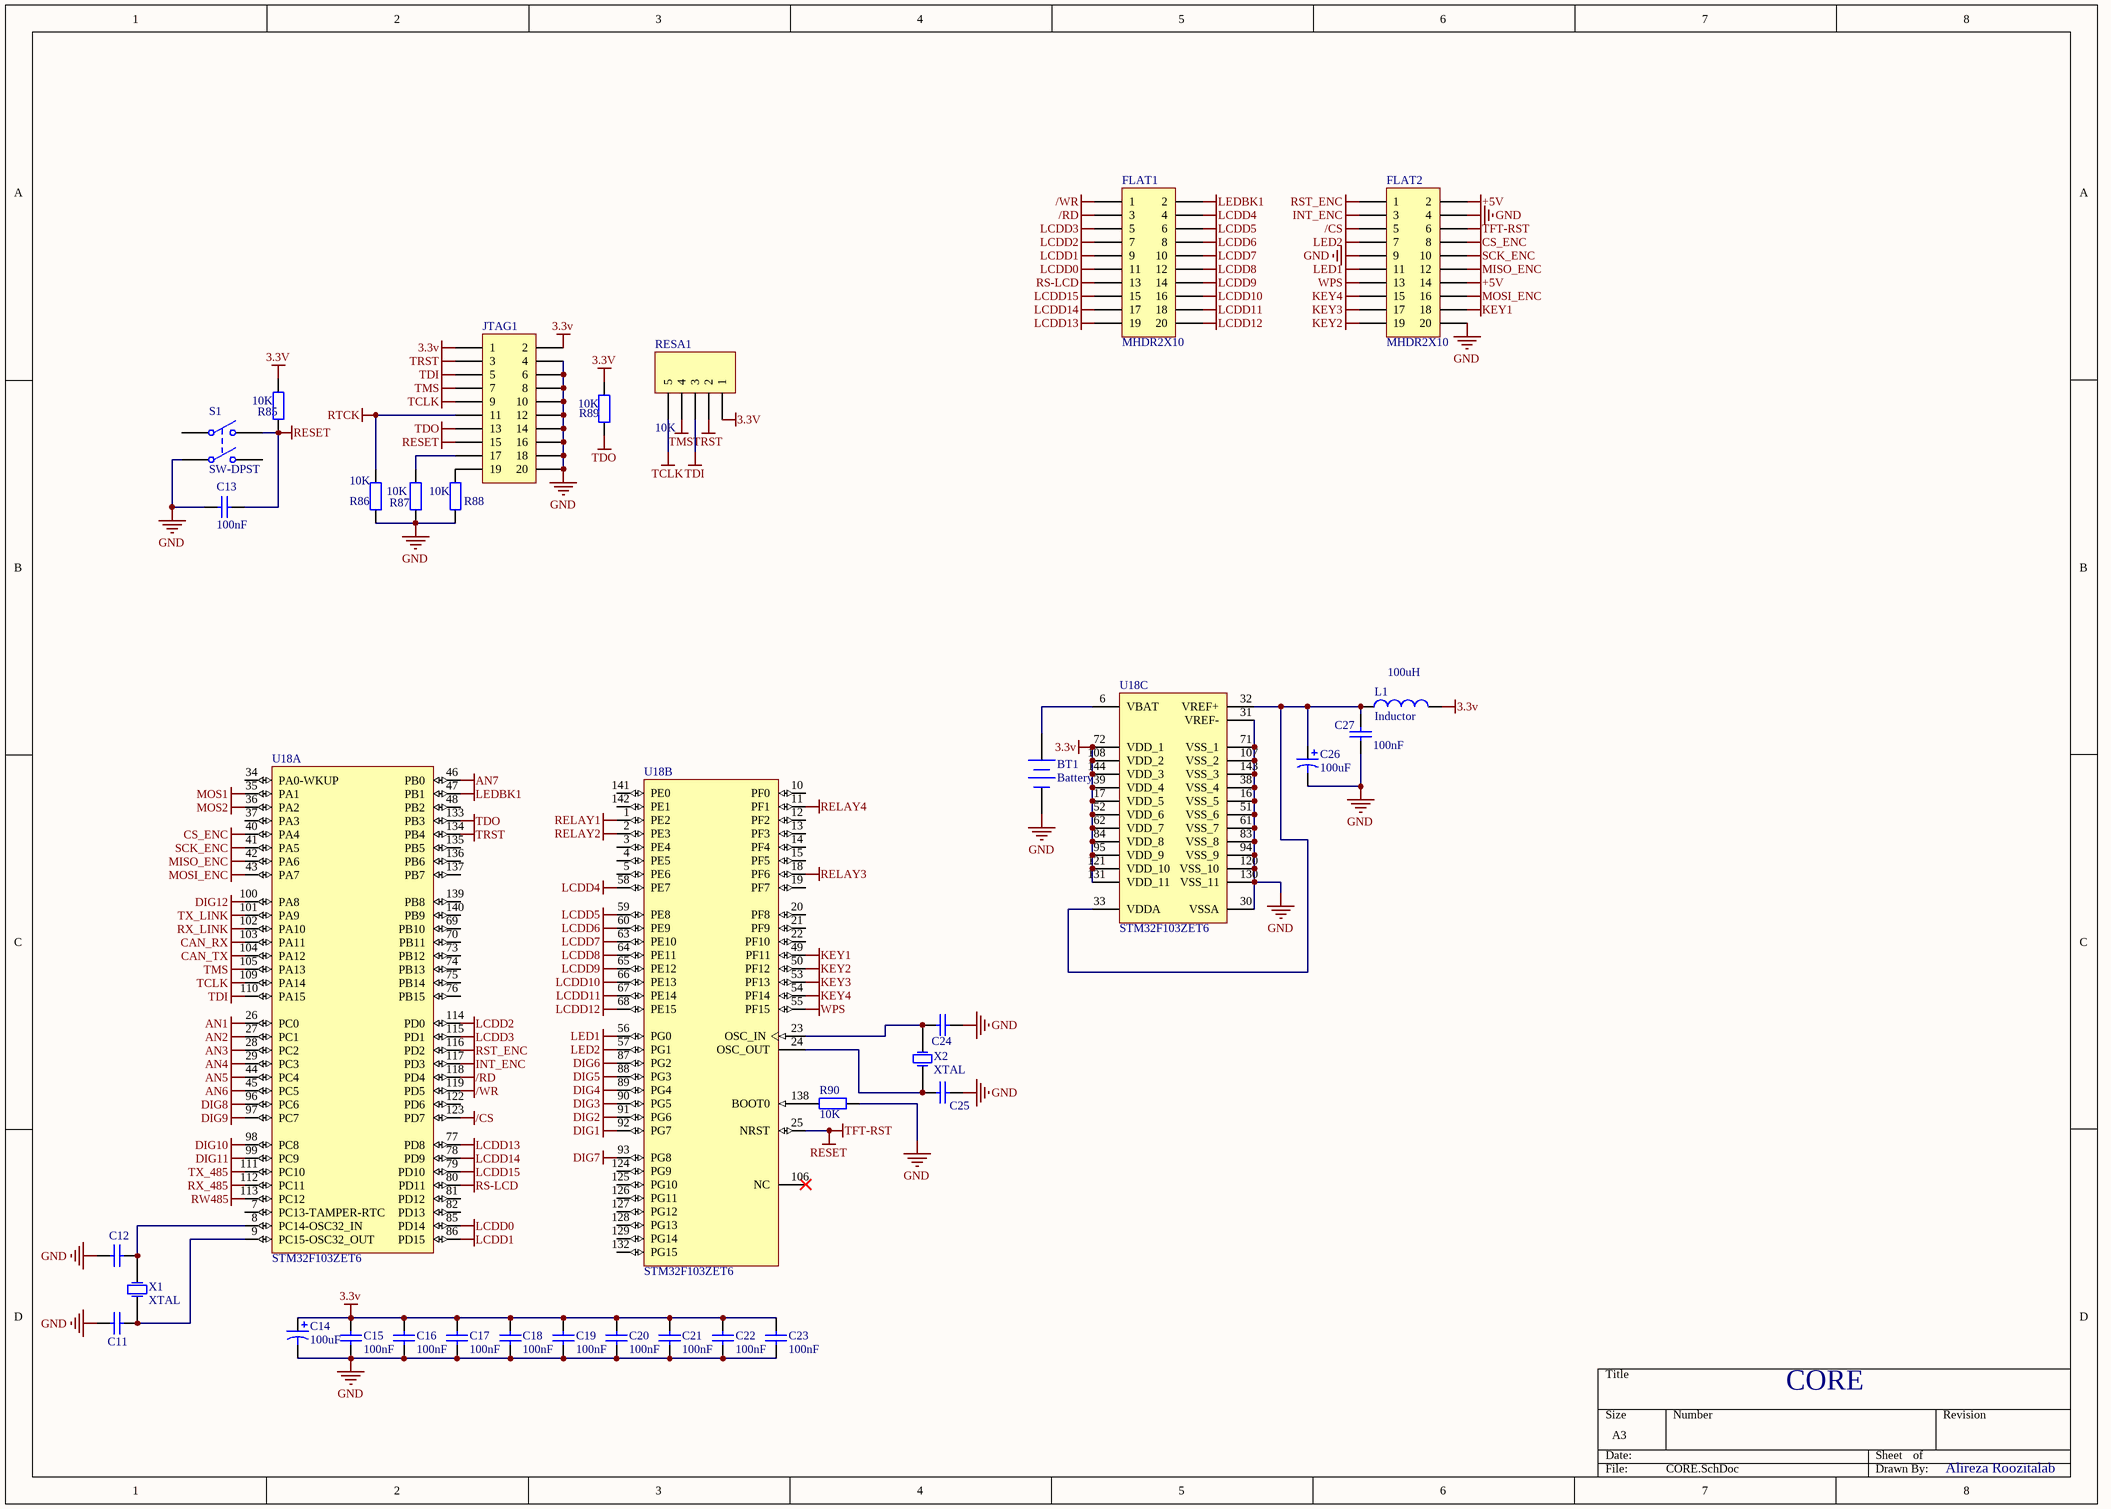
[diagram p5: CORE.SchDoc]

### Parts
BT1  Battery  [HDR1*2]
C11  Cap  [CAP 1206 (3216X08L)]  (value not drawn)
C12  Cap  [CAP 1206 (3216X08L)]  (value not drawn)
C13  value 100nF  [CAP 1206 (3216X08L)]  (hidden comment: Cap)
C14  value 100uF  [POL 100U16V]  (hidden comment: Cap Pol1)
C15  value 100nF  [CAP 1206 (3216X08L)]  (hidden comment: Cap)
C16  value 100nF  [CAP 1206 (3216X08L)]  (hidden comment: Cap)
C17  value 100nF  [CAP 1206 (3216X08L)]  (hidden comment: Cap)
C18  value 100nF  [CAP 1206 (3216X08L)]  (hidden comment: Cap)
C19  value 100nF  [CAP 1206 (3216X08L)]  (hidden comment: Cap)
C20  value 100nF  [CAP 1206 (3216X08L)]  (hidden comment: Cap)
C21  value 100nF  [CAP 1206 (3216X08L)]  (hidden comment: Cap)
C22  value 100nF  [CAP 1206 (3216X08L)]  (hidden comment: Cap)
C23  value 100nF  [CAP 1206 (3216X08L)]  (hidden comment: Cap)
C24  Cap  [CAP 1206 (3216X08L)]  (value not drawn)
C25  Cap  [CAP 1206 (3216X08L)]  (value not drawn)
C26  value 100uF  [POL 100U16V]  (hidden comment: Cap Pol1)
C27  value 100nF  [CAP 1206 (3216X08L)]  (hidden comment: Cap)
FLAT1  MHDR2X10  [box 20]
FLAT2  MHDR2X10  [box 20]
JTAG1  MHDR2X10  [box 20]  (value not drawn)
L1  Inductor  value 100uH  [TR]
R85  value 10K  [RES 1206 (3216X08L)]  (hidden comment: Res2)
R86  value 10K  [RES 1206 (3216X08L)]  (hidden comment: Res2)
R87  value 10K  [RES 1206 (3216X08L)]  (hidden comment: Res2)
R88  value 10K  [RES 1206 (3216X08L)]  (hidden comment: Res2)
R89  value 10K  [RES 1206 (3216X08L)]  (hidden comment: Res2)
R90  value 10K  [RES 1206 (3216X08L)]  (hidden comment: Res2)
RESA1  10K  [HEADER 5X1]
S1  SW-DPST  [SW4]
U18  STM32F103ZET6  [TQ144]  (parts A,B,C of 3)
X1  XTAL  [XTAL RTC]
X2  XTAL  [XTAL Small]

### Nets
3.3V: C14.1 C15.2 C16.2 C17.2 C18.2 C19.2 C20.2 C21.2 C22.2 C23.2 JTAG1.1 JTAG1.2 L1.2 R85.1 R89.1 RESA1.1 U18.17(VDD_5) U18.39(VDD_4) U18.52(VDD_6) U18.62(VDD_7) U18.72(VDD_1) U18.84(VDD_8) U18.95(VDD_9) U18.108(VDD_2) U18.121(VDD_10) U18.131(VDD_11) U18.144(VDD_3)
+5v: FLAT2.2 FLAT2.14
/CS: FLAT2.5 U18.123(PD7)
/RD: FLAT1.3 U18.118(PD4)
/WR: FLAT1.1 U18.119(PD5)
AN1: U18.26(PC0)
AN2: U18.27(PC1)
AN3: U18.28(PC2)
AN4: U18.29(PC3)
AN5: U18.44(PC4)
AN6: U18.45(PC5)
AN7: U18.46(PB0)
CAN_RX: U18.103(PA11)
CAN_TX: U18.104(PA12)
CS_ENC: FLAT2.8 U18.40(PA4)
dig1: U18.92(PG7)
dig2: U18.91(PG6)
dig3: U18.90(PG5)
dig4: U18.89(PG4)
dig5: U18.88(PG3)
dig6: U18.87(PG2)
dig7: U18.93(PG8)
dig8: U18.96(PC6)
dig9: U18.97(PC7)
dig10: U18.98(PC8)
dig11: U18.99(PC9)
dig12: U18.100(PA8)
GND: BT1.2(-) C11.2 C12.2 C13.2 C14.2 C15.1 C16.1 C17.1 C18.1 C19.1 C20.1 C21.1 C22.1 C23.1 C24.2 C25.2 C26.2 C27.1 FLAT2.4 FLAT2.9 FLAT2.20 JTAG1.4 JTAG1.6 JTAG1.8 JTAG1.10 JTAG1.12 JTAG1.14 JTAG1.16 JTAG1.18 JTAG1.20 R86.2 R87.2 R88.2 R90.2 S1.3(COMMON2) U18.16(VSS_5) U18.30(VSSA) U18.31(VREF-) U18.38(VSS_4) U18.51(VSS_6) U18.61(VSS_7) U18.71(VSS_1) U18.83(VSS_8) U18.94(VSS_9) U18.107(VSS_2) U18.120(VSS_10) U18.130(VSS_11) U18.143(VSS_3)
INT_ENC: FLAT2.3 U18.117(PD3)
KEY1: FLAT2.18 U18.49(PF11)
KEY2: FLAT2.19 U18.50(PF12)
KEY3: FLAT2.17 U18.53(PF13)
KEY4: FLAT2.15 U18.54(PF14)
LCDD0: FLAT1.11 U18.85(PD14)
LCDD1: FLAT1.9 U18.86(PD15)
LCDD2: FLAT1.7 U18.114(PD0)
LCDD3: FLAT1.5 U18.115(PD1)
LCDD4: FLAT1.4 U18.58(PE7)
LCDD5: FLAT1.6 U18.59(PE8)
LCDD6: FLAT1.8 U18.60(PE9)
LCDD7: FLAT1.10 U18.63(PE10)
LCDD8: FLAT1.12 U18.64(PE11)
LCDD9: FLAT1.14 U18.65(PE12)
LCDD10: FLAT1.16 U18.66(PE13)
LCDD11: FLAT1.18 U18.67(PE14)
LCDD12: FLAT1.20 U18.68(PE15)
LCDD13: FLAT1.19 U18.77(PD8)
LCDD14: FLAT1.17 U18.78(PD9)
LCDD15: FLAT1.15 U18.79(PD10)
LED1: FLAT2.11 U18.56(PG0)
LED2: FLAT2.7 U18.57(PG1)
LEDBK1: FLAT1.2 U18.47(PB1)
MISO_ENC: FLAT2.12 U18.42(PA6)
MOS1: U18.35(PA1)
MOS2: U18.36(PA2)
MOSI_ENC: FLAT2.16 U18.43(PA7)
RELAY1: U18.1(PE2)
RELAY2: U18.2(PE3)
RELAY3: U18.18(PF6)
RELAY4: U18.11(PF1)
RESET: C13.1 FLAT2.6 JTAG1.15 R85.2 S1.2(NO1) U18.25(NRST)  [also labelled TFT-RST]
RS-LCD: FLAT1.13 U18.80(PD11)
RST_ENC: FLAT2.1 U18.116(PD2)
RTCK: JTAG1.11 R86.1
RW485: U18.113(PC12)
RX_485: U18.112(PC11)
RX_LINK: U18.102(PA10)
SCK_ENC: FLAT2.10 U18.41(PA5)
TCLK: JTAG1.9 RESA1.5 U18.109(PA14)
TDI: JTAG1.5 RESA1.3 U18.110(PA15)
TDO: JTAG1.13 R89.2 U18.133(PB3)
TMS: JTAG1.7 RESA1.4 U18.105(PA13)
TRST: JTAG1.3 RESA1.2 U18.134(PB4)
TX_485: U18.111(PC10)
TX_LINK: U18.101(PA9)
WPS: FLAT2.13 U18.55(PF15)
NetBT1_1: BT1.1(+) U18.6(VBAT)
NetC11_1: C11.1 U18.9(PC15-OSC32_OUT) X1.2(OSC2)
NetC12_1: C12.1 U18.8(PC14-OSC32_IN) X1.1(OSC1)
NetC24_1: C24.1 U18.23(OSC_IN) X2.2(OSC2)
NetC25_1: C25.1 U18.24(OSC_OUT) X2.1(OSC1)
NetC26_1: C26.1 C27.2 L1.1 U18.32(VREF+) U18.33(VDDA)
NetJTAG1_17: JTAG1.17 R87.1
NetJTAG1_19: JTAG1.19 R88.1
NetR90_1: R90.1 U18.138(BOOT0)

Not connected (* = marked no-connect by the designer): S1 1(COMMON1) 4(NO2); U18 3(PE4) 4(PE5) 5(PE6) 7(PC13-TAMPER-RTC) 10(PF0) 12(PF2) 13(PF3) 14(PF4) 15(PF5) 19(PF7) 20(PF8) 21(PF9) 22(PF10) 34(PA0-WKUP) 37(PA3) 48(PB2) 69(PB10) 70(PB11) 73(PB12) 74(PB13) 75(PB14) 76(PB15) 81(PD12) 82(PD13) 106(NC)* 122(PD6) 124(PG9) 125(PG10) 126(PG11) 127(PG12) 128(PG13) 129(PG14) 132(PG15) 135(PB5) 136(PB6) 137(PB7) 139(PB8) 140(PB9) 141(PE0) 142(PE1)

### Notes on the sheet
- CORE
- Alireza Roozitalab

### Library data of the parts
BT1 = Battery: Multicell Battery; Published: 24-Mar-1999; LatestRevisionDate: 17-Jul-2002; LatestRevisionNote: Re-released for DXP Platform.; PackageReference: BAT-2; Publisher: Altium Limited
C11 C12 C24 C25 = Cap: Capacitor; Value: 100nF; Published: 8-Jun-2000; LatestRevisionDate: 17-Jul-2002; LatestRevisionNote: Re-released for DXP Platform.; PackageReference: RAD-0.3; Publisher: Altium Limited
C13 C15-C23 C27 = Cap: Capacitor; Published: 8-Jun-2000; LatestRevisionDate: 17-Jul-2002; LatestRevisionNote: Re-released for DXP Platform.; PackageReference: RAD-0.3; Publisher: Altium Limited
C14 C26 = Cap Pol1: Polarized Capacitor (Radial); Published: 8-Jun-2000; LatestRevisionDate: 17-Jul-2002; LatestRevisionNote: Re-released for DXP Platform.; PackageReference: RB7.6-15; Publisher: Altium Limited
FLAT1 FLAT2 JTAG1 = MHDR2X10: Header, 10-Pin, Dual row; LatestRevisionDate: 17-Jul-2002; LatestRevisionNote: Re-released for DXP Platform.; Publisher: Altium Limited
L1 = Inductor: Code_IEC: 1005; Published: 8-Jun-2000; LatestRevisionDate: 17-Jul-2002; LatestRevisionNote: Re-released for DXP Platform.; PackageReference: 0402-A; Publisher: Altium Limited; Code_JEITA: 0402
R85-R90 = Res2: Resistor; Published: 8-Jun-2000; LatestRevisionDate: 17-Jul-2002; LatestRevisionNote: Re-released for DXP Platform.; PackageReference: AXIAL-0.4; Publisher: Altium Limited
RESA1 = MHDR1X5: Header, 5-Pin; LatestRevisionDate: 17-Jul-2002; LatestRevisionNote: Re-released for DXP Platform.; Publisher: Altium Limited
S1 = SW-DPST: Double-Pole, Single-Throw Switch; Published: 24-Mar-1999; LatestRevisionDate: 17-Jul-2002; LatestRevisionNote: Re-released for DXP Platform.; PackageReference: DPST-4; Publisher: Altium Limited
U18 = STM32F103ZET6: ARM Cortex-M3 32-bit MCU, 512 KB Flash, 64 KB Internal RAM, 112 I/Os, 144-pin LQFP, -40 to 85 degC, Tray; A/D Converter: 3x12-bit (21 Channel); D/A Converter: 2x12-bit (2 Channel); FLASH Size (Prog) (kB): 512; I/Os (High Current): 112; Internal RAM Size (kB): 64; Operating Frequency(F) (Processor speed) (MHz): 72; Supply Voltage(Vcc) min (V): 2; DatasheetVersion: Rev. 8; PackageVersion: Rev. 4, 06/2013; PackageReference: LQFP144; PackageDescription: 144-Pin Low Profile Quad Flat Package, 20 x 20 mm Body, 0.5 mm Pitch; Supplier 1: Digi-Key; Supplier Part Number 1: 497-6442-ND; Supplier 2: Farnell; Supplier Part Number 2: 1624145; Supplier 3: Newark; Supplier Part Number 3: 57P1270; Supplier 4: Mouser; Supplier Part Number 4: 511-STM32F103ZET6; Core: ARM Cortex-M3; Packing: Tray; Mounting Technology: Surface Mount; PartNumber: STM32F103ZET6; ComponentLink1Description: Manufacturer URL; ComponentLink1URL: http://www.st.com/web/en/home.html; ComponentLink2Description: Datasheet; ComponentLink2URL: http://www.st.com/st-web-ui/static/active/en/resource/technical/document/datasheet/CD00191185.pdf; ComponentLink3Description: Package Specification; ComponentLink3URL: http://www.st.com/st-web-ui/static/active/en/resource/technical/document/datasheet/DM00037051.pdf
X1 X2 = XTAL: Crystal Oscillator; Published: 8-Jun-2000; LatestRevisionDate: 17-Jul-2002; LatestRevisionNote: Re-released for DXP Platform.; PackageReference: R38; Publisher: Altium Limited

## Sheet POWER.SchDoc
size 199 x 100 mm
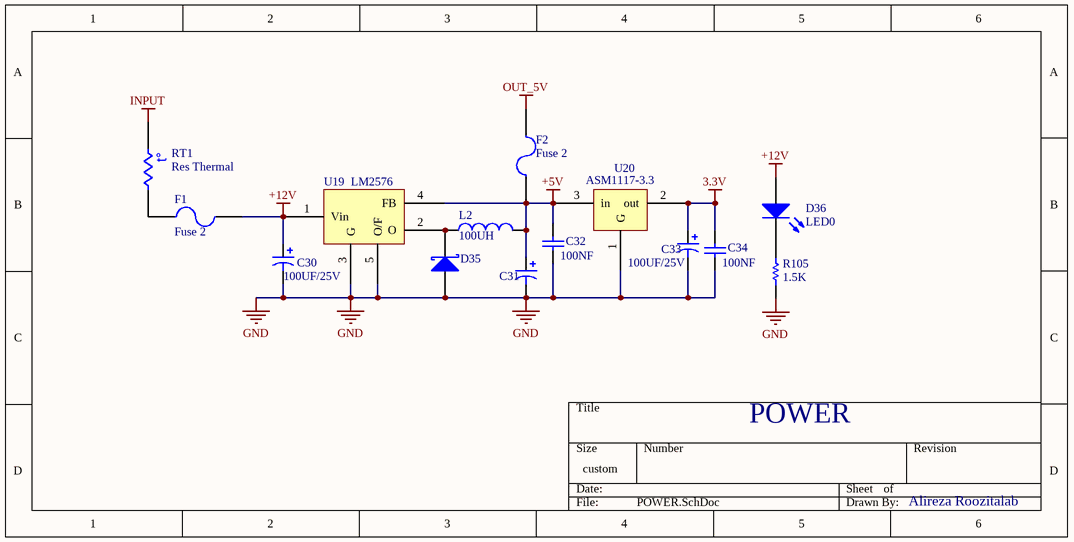
[diagram p6: POWER.SchDoc]

### Parts
C30  value 100UF/25V  [POL 220U/35V]  (hidden comment: Cap Pol1)
C31  Cap Pol1  [POL 220U/35V]  (value not drawn)
C32  value 100NF  [REC 10N]  (hidden comment: Cap)
C33  value 100UF/25V  [POL 100U/25V]  (hidden comment: Cap Pol1)
C34  value 100NF  [REC 10N]  (hidden comment: Cap)
D35  D Schottky  [DO214AC]  (value not drawn)
D36  LED0  [led-1206]
F1  Fuse 2  [fuse plastic holder]
F2  Fuse 2  [fuse plastic holder]
L2  value 100UH  [TR]  (hidden comment: Inductor)
R105  value 1.5K  [RES 1206 (3216X08L)]  (hidden comment: Res1)
RT1  Res Thermal  [Varistor Short Hieght - Vertical]
U19  LM2576  [d2pak5-lead]
U20  ASM1117-3.3  [SOT-223]

### Nets
3.3V: C33.1 C34.2 U20.2(out)
+5v: C31.1 C32.2 F2.1 L2.2 U19.4(FB) U20.3(in)
+12v: C30.1 D36.1(A) F1.2 U19.1(Vin)
GND: C30.2 C31.2 C32.1 C33.2 C34.1 D35.1(A) R105.1 U19.3(G) U19.5(O/F) U20.1(G)
INPUT: RT1.1
OUT_5V: F2.2
NetD35_2: D35.2(K) L2.1 U19.2(O)
NetD36_2: D36.2(K) R105.2
NetF1_1: F1.1 RT1.2

### Notes on the sheet
- POWER
- Alireza Roozitalab
- (in symbol Res Thermal) t°

### Library data of the parts
C30 C33 = Cap Pol1: Polarized Capacitor (Radial); Published: 8-Jun-2000; LatestRevisionDate: 17-Jul-2002; LatestRevisionNote: Re-released for DXP Platform.; PackageReference: RB7.6-15; Publisher: Altium Limited
C31 = Cap Pol1: Polarized Capacitor (Radial); Value: 100UF/25v; Published: 8-Jun-2000; LatestRevisionDate: 17-Jul-2002; LatestRevisionNote: Re-released for DXP Platform.; PackageReference: RB7.6-15; Publisher: Altium Limited
C32 C34 = Cap: Capacitor; Published: 8-Jun-2000; LatestRevisionDate: 17-Jul-2002; LatestRevisionNote: Re-released for DXP Platform.; PackageReference: RAD-0.3; Publisher: Altium Limited
D35 = D Schottky: Schottky Diode; Published: 8-Jun-2000; LatestRevisionDate: 17-Jul-2002; LatestRevisionNote: Re-released for DXP Platform.; PackageReference: SMB; Publisher: Altium Limited; Code_JEDEC: DO-214-AA
D36 = LED0: Typical INFRARED GaAs LED; Published: 8-Jun-2000; LatestRevisionDate: 08-Jul-2005; LatestRevisionNote: Mech Layer 1 removed.; PackageReference: LED-0; Publisher: Altium Limited
F1 F2 = Fuse 2: Fuse; Published: 8-Jun-2000; LatestRevisionDate: 17-Jul-2002; LatestRevisionNote: Re-released for DXP Platform.; PackageReference: PIN-W2/E2.8; Publisher: Altium Limited
L2 = Inductor: Code_IEC: 1005; Published: 8-Jun-2000; LatestRevisionDate: 17-Jul-2002; LatestRevisionNote: Re-released for DXP Platform.; PackageReference: 0402-A; Publisher: Altium Limited; Code_JEITA: 0402
R105 = Res1: Resistor; Published: 8-Jun-2000; LatestRevisionDate: 17-Jul-2002; LatestRevisionNote: Re-released for DXP Platform.; PackageReference: AXIAL-0.3; Publisher: Altium Limited
RT1 = Res Thermal: Thermistor; Published: 24-Mar-1999; LatestRevisionDate: 04-Mar-2005; LatestRevisionNote: PCB Footprint replaced.; PackageReference: 6-0805; Publisher: Altium Limited
U19 = LM2576-5V

## Sheet OUTPUT.SchDoc: OUTPUT BLOCK
size 180 x 80 mm; Revision: 1
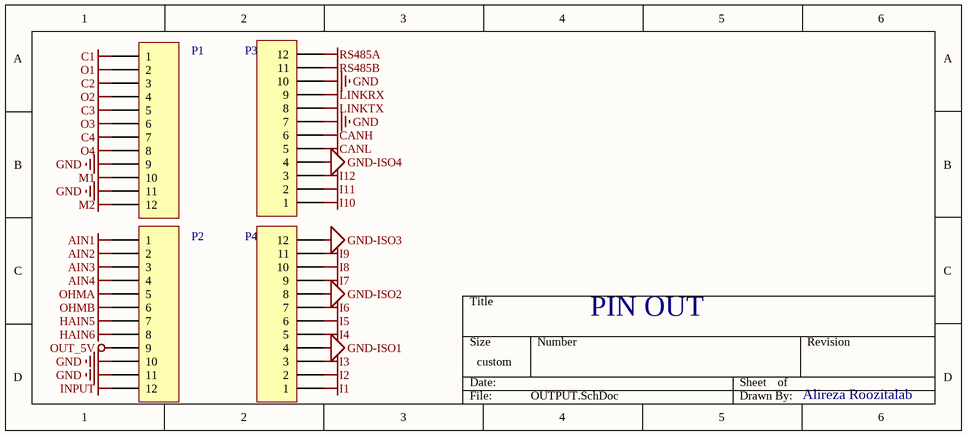
[diagram p7: OUTPUT.SchDoc]

### Parts
P1  MHDR1X12  [W23112R5MILH]  (value not drawn)
P2  MHDR1X12  [W23112R5MILH]  (value not drawn)
P3  MHDR1X12  [W23112R5MILH]  (value not drawn)
P4  MHDR1X12  [W23112R5MILH]  (value not drawn)

### Nets
AIN1: P2.1
AIN2: P2.2
AIN3: P2.3
AIN4: P2.4
C1: P1.1
C2: P1.3
C3: P1.5
C4: P1.7
CANH: P3.6
CANL: P3.5
GND: P1.9 P1.11 P2.10 P2.11 P3.7 P3.10
GND-iso1: P4.4
GND-iso2: P4.8
GND-iso3: P4.12
GND-iso4: P3.4
HAIN5: P2.7
HAIN6: P2.8
I1: P4.1
I2: P4.2
I3: P4.3
I4: P4.5
I5: P4.6
I6: P4.7
I7: P4.9
I8: P4.10
I9: P4.11
I10: P3.1
I11: P3.2
I12: P3.3
INPUT: P2.12
LINKRX: P3.9
LINKTX: P3.8
M1: P1.10
M2: P1.12
O1: P1.2
O2: P1.4
O3: P1.6
O4: P1.8
OHMA: P2.5
OHMB: P2.6
OUT_5V: P2.9
RS485A: P3.12
RS485B: P3.11

### Notes on the sheet
- PIN OUT
- Alireza Roozitalab

### Library data of the parts
P1-P4 = MHDR1X12: Header, 12-Pin; LatestRevisionDate: 17-Jul-2002; LatestRevisionNote: Re-released for DXP Platform.; Publisher: Altium Limited

## Nets that join several sheets
3.3V: DIGITAL (12 pins), COMMUNICATION (R71.2 R76.1 R80.1), CORE (27 pins), POWER (C33.1 C34.2 U20.2)
+5v: ANALOG (C7.2 U13.4 U14.3 U15.4), MOSFET (DR1.6), COMMUNICATION (R72.2 R79.1 U16.3 U17.8), CORE (FLAT2.2 FLAT2.14), POWER (6 pins)
+12v: RELAY (8 pins), POWER (C30.1 D36.1 F1.2 U19.1)
AIN1: ANALOG (R37.2 R41.1), OUTPUT (P2.1)
AIN2: ANALOG (R38.2 R42.1), OUTPUT (P2.2)
AIN3: ANALOG (R39.2 R43.1), OUTPUT (P2.3)
AIN4: ANALOG (R40.2 R44.1), OUTPUT (P2.4)
AN1: ANALOG (D17.2 R53.2), CORE (U18.26)
AN2: ANALOG (D18.2 R54.2), CORE (U18.27)
AN3: ANALOG (D19.2 R55.2), CORE (U18.28)
AN4: ANALOG (D20.2 R56.2), CORE (U18.29)
AN5: ANALOG (D26.2 R68.2), CORE (U18.44)
AN6: ANALOG (D27.2 R69.2), CORE (U18.45)
AN7: ANALOG (D28.2 R70.2), CORE (U18.46)
C1: RELAY (K1.1), OUTPUT (P1.1)
C2: RELAY (K2.1), OUTPUT (P1.3)
C3: RELAY (K3.1), OUTPUT (P1.5)
C4: RELAY (K4.1), OUTPUT (P1.7)
CAN_RX: COMMUNICATION (R71.1 U16.4), CORE (U18.103)
CAN_TX: COMMUNICATION (R76.2 U16.1), CORE (U18.104)
CANH: COMMUNICATION (R81.1 U16.7), OUTPUT (P3.6)
CANL: COMMUNICATION (U16.6 W6.1), OUTPUT (P3.5)
dig1: DIGITAL (R13.1 U1.4), CORE (U18.92)
dig2: DIGITAL (R14.1 U2.4), CORE (U18.91)
dig3: DIGITAL (R15.1 U3.4), CORE (U18.90)
dig4: DIGITAL (R16.1 U4.4), CORE (U18.89)
dig5: DIGITAL (R17.1 U5.4), CORE (U18.88)
dig6: DIGITAL (R18.1 U6.4), CORE (U18.87)
dig7: DIGITAL (R31.1 U7.4), CORE (U18.93)
dig8: DIGITAL (R32.1 U8.4), CORE (U18.96)
dig9: DIGITAL (R33.1 U9.4), CORE (U18.97)
dig10: DIGITAL (R34.1 U10.4), CORE (U18.98)
dig11: DIGITAL (R35.1 U11.4), CORE (U18.99)
dig12: DIGITAL (R36.1 U12.4), CORE (U18.100)
GND: DIGITAL (12 pins), RELAY (8 pins), ANALOG (40 pins), MOSFET (DR1.3 Q5.3 Q6.3), COMMUNICATION (10 pins), CORE (48 pins), POWER (10 pins), OUTPUT (6 pins)
GND-iso1: DIGITAL (6 pins), OUTPUT (P4.4)
GND-iso2: DIGITAL (6 pins), OUTPUT (P4.8)
GND-iso3: DIGITAL (6 pins), OUTPUT (P4.12)
GND-iso4: DIGITAL (6 pins), OUTPUT (P3.4)
HAIN5: ANALOG (R57.1), OUTPUT (P2.7)
HAIN6: ANALOG (R58.1), OUTPUT (P2.8)
I1: DIGITAL (R1.1), OUTPUT (P4.1)
I2: DIGITAL (R2.1), OUTPUT (P4.2)
I3: DIGITAL (R3.1), OUTPUT (P4.3)
I4: DIGITAL (R4.1), OUTPUT (P4.5)
I5: DIGITAL (R5.1), OUTPUT (P4.6)
I6: DIGITAL (R6.1), OUTPUT (P4.7)
I7: DIGITAL (R19.1), OUTPUT (P4.9)
I8: DIGITAL (R20.1), OUTPUT (P4.10)
I9: DIGITAL (R21.1), OUTPUT (P4.11)
I10: DIGITAL (R22.1), OUTPUT (P3.1)
I11: DIGITAL (R23.1), OUTPUT (P3.2)
I12: DIGITAL (R24.1), OUTPUT (P3.3)
INPUT: POWER (RT1.1), OUTPUT (P2.12)
LINKRX: COMMUNICATION (R82.2), OUTPUT (P3.9)
LINKTX: COMMUNICATION (Q1.3 R79.2), OUTPUT (P3.8)
M1: MOSFET (Q5.2), OUTPUT (P1.10)
M2: MOSFET (Q6.2), OUTPUT (P1.12)
MOS1: MOSFET (R93.1), CORE (U18.35)
MOS2: MOSFET (R94.1), CORE (U18.36)
O1: RELAY (K1.3), OUTPUT (P1.2)
O2: RELAY (K2.3), OUTPUT (P1.4)
O3: RELAY (K3.3), OUTPUT (P1.6)
O4: RELAY (K4.3), OUTPUT (P1.8)
OHMA: ANALOG (R61.1 U15.10), OUTPUT (P2.5)
OHMB: ANALOG (R62.2), OUTPUT (P2.6)
OUT_5V: POWER (F2.2), OUTPUT (P2.9)
RELAY1: RELAY (R97.2), CORE (U18.1)
RELAY2: RELAY (R99.2), CORE (U18.2)
RELAY3: RELAY (R101.2), CORE (U18.18)
RELAY4: RELAY (R103.2), CORE (U18.11)
RS485A: COMMUNICATION (R72.1 R73.2 U17.6), OUTPUT (P3.12)
RS485B: COMMUNICATION (R74.2 U17.7 W5.1), OUTPUT (P3.11)
RW485: COMMUNICATION (R83.2 U17.2 U17.3), CORE (U18.113)
RX_485: COMMUNICATION (D30.2 R84.1), CORE (U18.112)
RX_LINK: COMMUNICATION (Q2.3 R80.2), CORE (U18.102)
TX_485: COMMUNICATION (U17.4), CORE (U18.111)
TX_LINK: COMMUNICATION (R75.2), CORE (U18.101)